# Altium project GPSDevice.PrjPcb
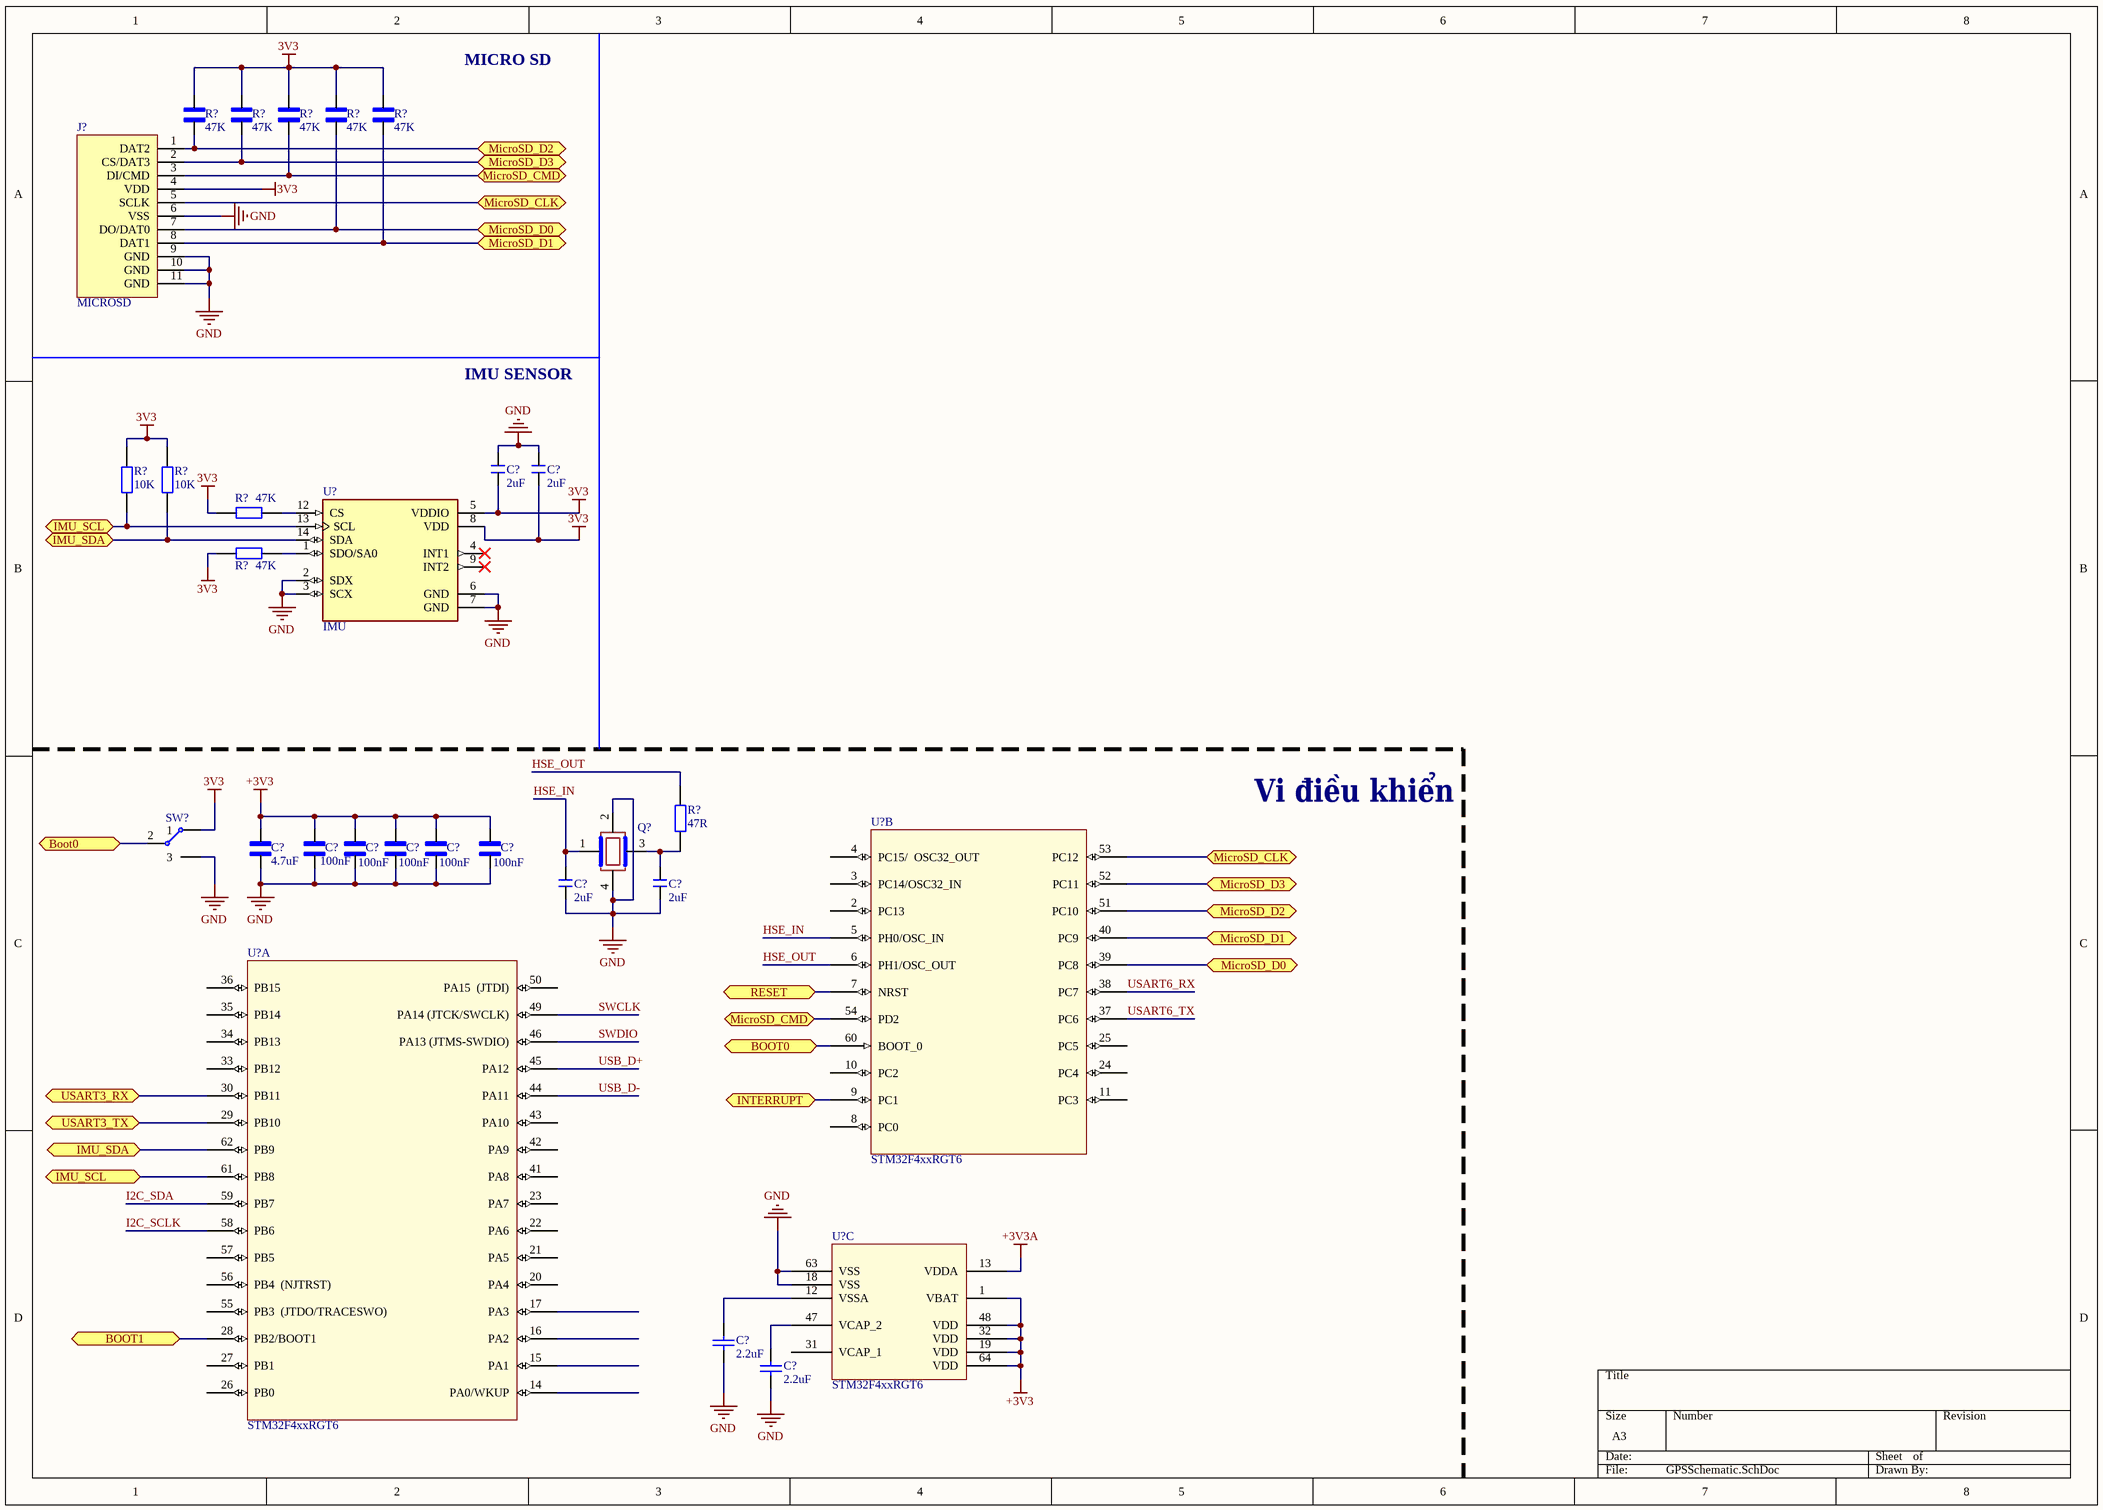
[diagram p0: GPSSchematic.SchDoc]
2 sheets, 84 parts. Net scope: flat (ports and power ports of the same name join across sheets).
Board file: GPSPCB.PcbDoc
Sheets:
  GPSSchematic.SchDoc
  Sim7600Schematic.SchDoc

## Sheet GPSSchematic.SchDoc
size A3

### Parts
(Parts that share a designator on the sheet are numbered #1, #2 ... from top to bottom, then left to right.)
C?#1  2uF  [CAPC 4.7uF 0603]
C?#2  2uF  [CAPC 4.7uF 0603]
C?#3  100nF  [CAP 0402]
C?#4  100nF  [CAP 0402]
C?#5  100nF  [CAP 0402]
C?#6  100nF  [CAP 0402]
C?#7  100nF  [CAP 0402]
C?#8  4.7uF  [CAPC 4.7uF 0603]
C?#9  2uF
C?#10  2uF
C?#11  2.2uF  [CAP 0402]
C?#12  2.2uF  [CAP 0402]
J?  MICROSD  [MICROSD]
Q?#1  CRYSTAL2  (value not drawn)
R?#1  47K  [RES 0402]
R?#2  47K  [RES 0402]
R?#3  47K  [RES 0402]
R?#4  47K  [RES 0402]
R?#5  47K  [RES 0402]
R?#6  10K  [RES 0603 47R]
R?#7  10K  [RES 0603 47R]
R?#8  47K  [RES 0603 47R]
R?#9  47K  [RES 0603 47R]
R?#10  47R  [RES 0603 47R]
SW?  Switch_Slide 3 Port  [Switch 4mm]  (value not drawn)
U?#1  IMU  [IMU]
U?#2  STM32F4xxRGT6  (part B of 3)
U?#3  STM32F4xxRGT6  (part A of 3)
U?#4  STM32F4xxRGT6  (part C of 3)

### Ports
BOOT0, Boot0, BOOT1, IMU_SCL, IMU_SDA, INTERRUPT, MicroSD_CLK, MicroSD_CMD, MicroSD_D0, MicroSD_D1, MicroSD_D2, MicroSD_D3, RESET, USART3_RX, USART3_TX

### Nets
3V3: C?#1.?1 C?#2.?1 J?.4(VDD) R?#1.1 R?#2.1 R?#3.1 R?#4.1 R?#5.1 R?#6.2 R?#7.2 R?#8.1 R?#9.1 SW?.1 U?#1.5(VDDIO) U?#1.8(VDD)
+3V3: C?#3.2 C?#4.2 C?#5.2 C?#6.2 C?#7.2 C?#8.2 U?#4.1(VBAT) U?#4.19(VDD) U?#4.32(VDD) U?#4.48(VDD) U?#4.64(VDD)
+3V3A: U?#4.13(VDDA)
GND: C?#1.?2 C?#2.?2 C?#3.1 C?#4.1 C?#5.1 C?#6.1 C?#7.1 C?#8.1 C?#9.?1 C?#10.?1 C?#11.1 C?#12.1 J?.6(VSS) J?.9(GND) J?.10(GND) J?.11(GND) Q?#1.2 Q?#1.4 SW?.3 U?#1.2(SDX) U?#1.3(SCX) U?#1.6(GND) U?#1.7(GND) U?#4.18(VSS) U?#4.63(VSS)
HSE_IN: C?#9.?2 Q?#1.1 U?#2.5(PH0/OSC_IN)
HSE_OUT: R?#10.2 U?#2.6(PH1/OSC_OUT)
I2C_SCLK: U?#3.58(PB6)
I2C_SDA: U?#3.59(PB7)
SWCLK: U?#3.49(PA14_(JTCK/SWCLK))
SWDIO: U?#3.46(PA13_(JTMS-SWDIO))
USART6_RX: U?#2.38(PC7)
USART6_TX: U?#2.37(PC6)
USB_D+: U?#3.45(PA12)
USB_D-: U?#3.44(PA11)
NetC?#10_?2: C?#10.?2 Q?#1.3 R?#10.1
NetC?#11_2: C?#11.2 U?#4.12(VSSA)
NetC?#12_2: C?#12.2 U?#4.47(VCAP_2)
NetJ?_1: J?.1(DAT2) R?#1.2 U?#2.51(PC10) ; port MicroSD_D2
NetJ?_2: J?.2(CS/DAT3) R?#2.2 U?#2.52(PC11) ; port MicroSD_D3
NetJ?_3: J?.3(DI/CMD) R?#3.2 U?#2.54(PD2) ; port MicroSD_CMD
NetJ?_5: J?.5(SCLK) U?#2.53(PC12) ; port MicroSD_CLK
NetJ?_7: J?.7(DO/DAT0) R?#4.2 U?#2.39(PC8) ; port MicroSD_D0
NetJ?_8: J?.8(DAT1) R?#5.2 U?#2.40(PC9) ; port MicroSD_D1
NetR?#6_1: R?#6.1 U?#1.13(SCL) U?#3.61(PB8) ; port IMU_SCL
NetR?#7_1: R?#7.1 U?#1.14(SDA) U?#3.62(PB9) ; port IMU_SDA
NetR?#8_2: R?#8.2 U?#1.12(CS)
NetR?#9_2: R?#9.2 U?#1.1(SDO/SA0)
NetSW?_2: SW?.2 U?#2.60(BOOT_0) ; port BOOT0, port Boot0
NetU?#2_7: U?#2.7(NRST) ; port RESET
NetU?#2_9: U?#2.9(PC1) ; port INTERRUPT
NetU?#3_28: U?#3.28(PB2/BOOT1) ; port BOOT1
NetU?#3_29: U?#3.29(PB10) ; port USART3_TX
NetU?#3_30: U?#3.30(PB11) ; port USART3_RX

Not connected (* = marked no-connect by the designer): U?#1 4(INT1)* 9(INT2)*; U?#2 2(PC13) 3(PC14/OSC32_IN) 4(PC15/__OSC32_OUT) 8(PC0) 10(PC2) 11(PC3) 24(PC4) 25(PC5); U?#3 14(PA0/WKUP) 15(PA1) 16(PA2) 17(PA3) 20(PA4) 21(PA5) 22(PA6) 23(PA7) 26(PB0) 27(PB1) 33(PB12) 34(PB13) 35(PB14) 36(PB15) 41(PA8) 42(PA9) 43(PA10) 50(PA15__(JTDI)) 55(PB3__(JTDO/TRACESWO)) 56(PB4__(NJTRST)) 57(PB5); U?#4 31(VCAP_1)

### Notes on the sheet
- MICRO SD
- IMU SENSOR
- Vi điều khiển

### Library data of the parts
C?#1 C?#2 C?#9 C?#10 = Cap 2uf 0603
C?#3-C?#7 = CAP 100nF
C?#8 = CAP 4.7uF: MP: GRM188C71C475KE21D; Package: None; Price: None; Value: *; Availability: Unavailable
C?#11 C?#12 = CAP 0402
R?#1-R?#5 = RES 0402: 1 kOhms Â±1% 0.1W, 1/10W Chip Resistor 0402 _1005 Metric_ Anti-Sulfur Thin Film; MP: S-0402; MF: Johanson; Price: None; Package: 0402 Johanson; Value: *; Availability: Unavailable; SnapEDA_Link: https://www.snapeda.com/parts/S-0402/Johanson/view-part/4220759/?ref=snap
R?#6-R?#10 = RES 47R 0603
SW? = Switch_Slide 3 Port: Manu numb: OS102011MS2QN1
U?#1 = IMU: Accelerometer, Gyroscope, Temperature, 6 Axis Sensor IÂ²C, SPI Output; MP: LSM6DSLTR; MF: STMicroelectronics; SnapEDA_Link: https://www.snapeda.com/parts/LSM6DSLTR/STMicroelectronics/view-part/550517/?ref=snap; Availability: Unavailable; Value: *; Price: None; Package: LGA-14 STMicroelectronics

## Sheet Sim7600Schematic.SchDoc
size A3
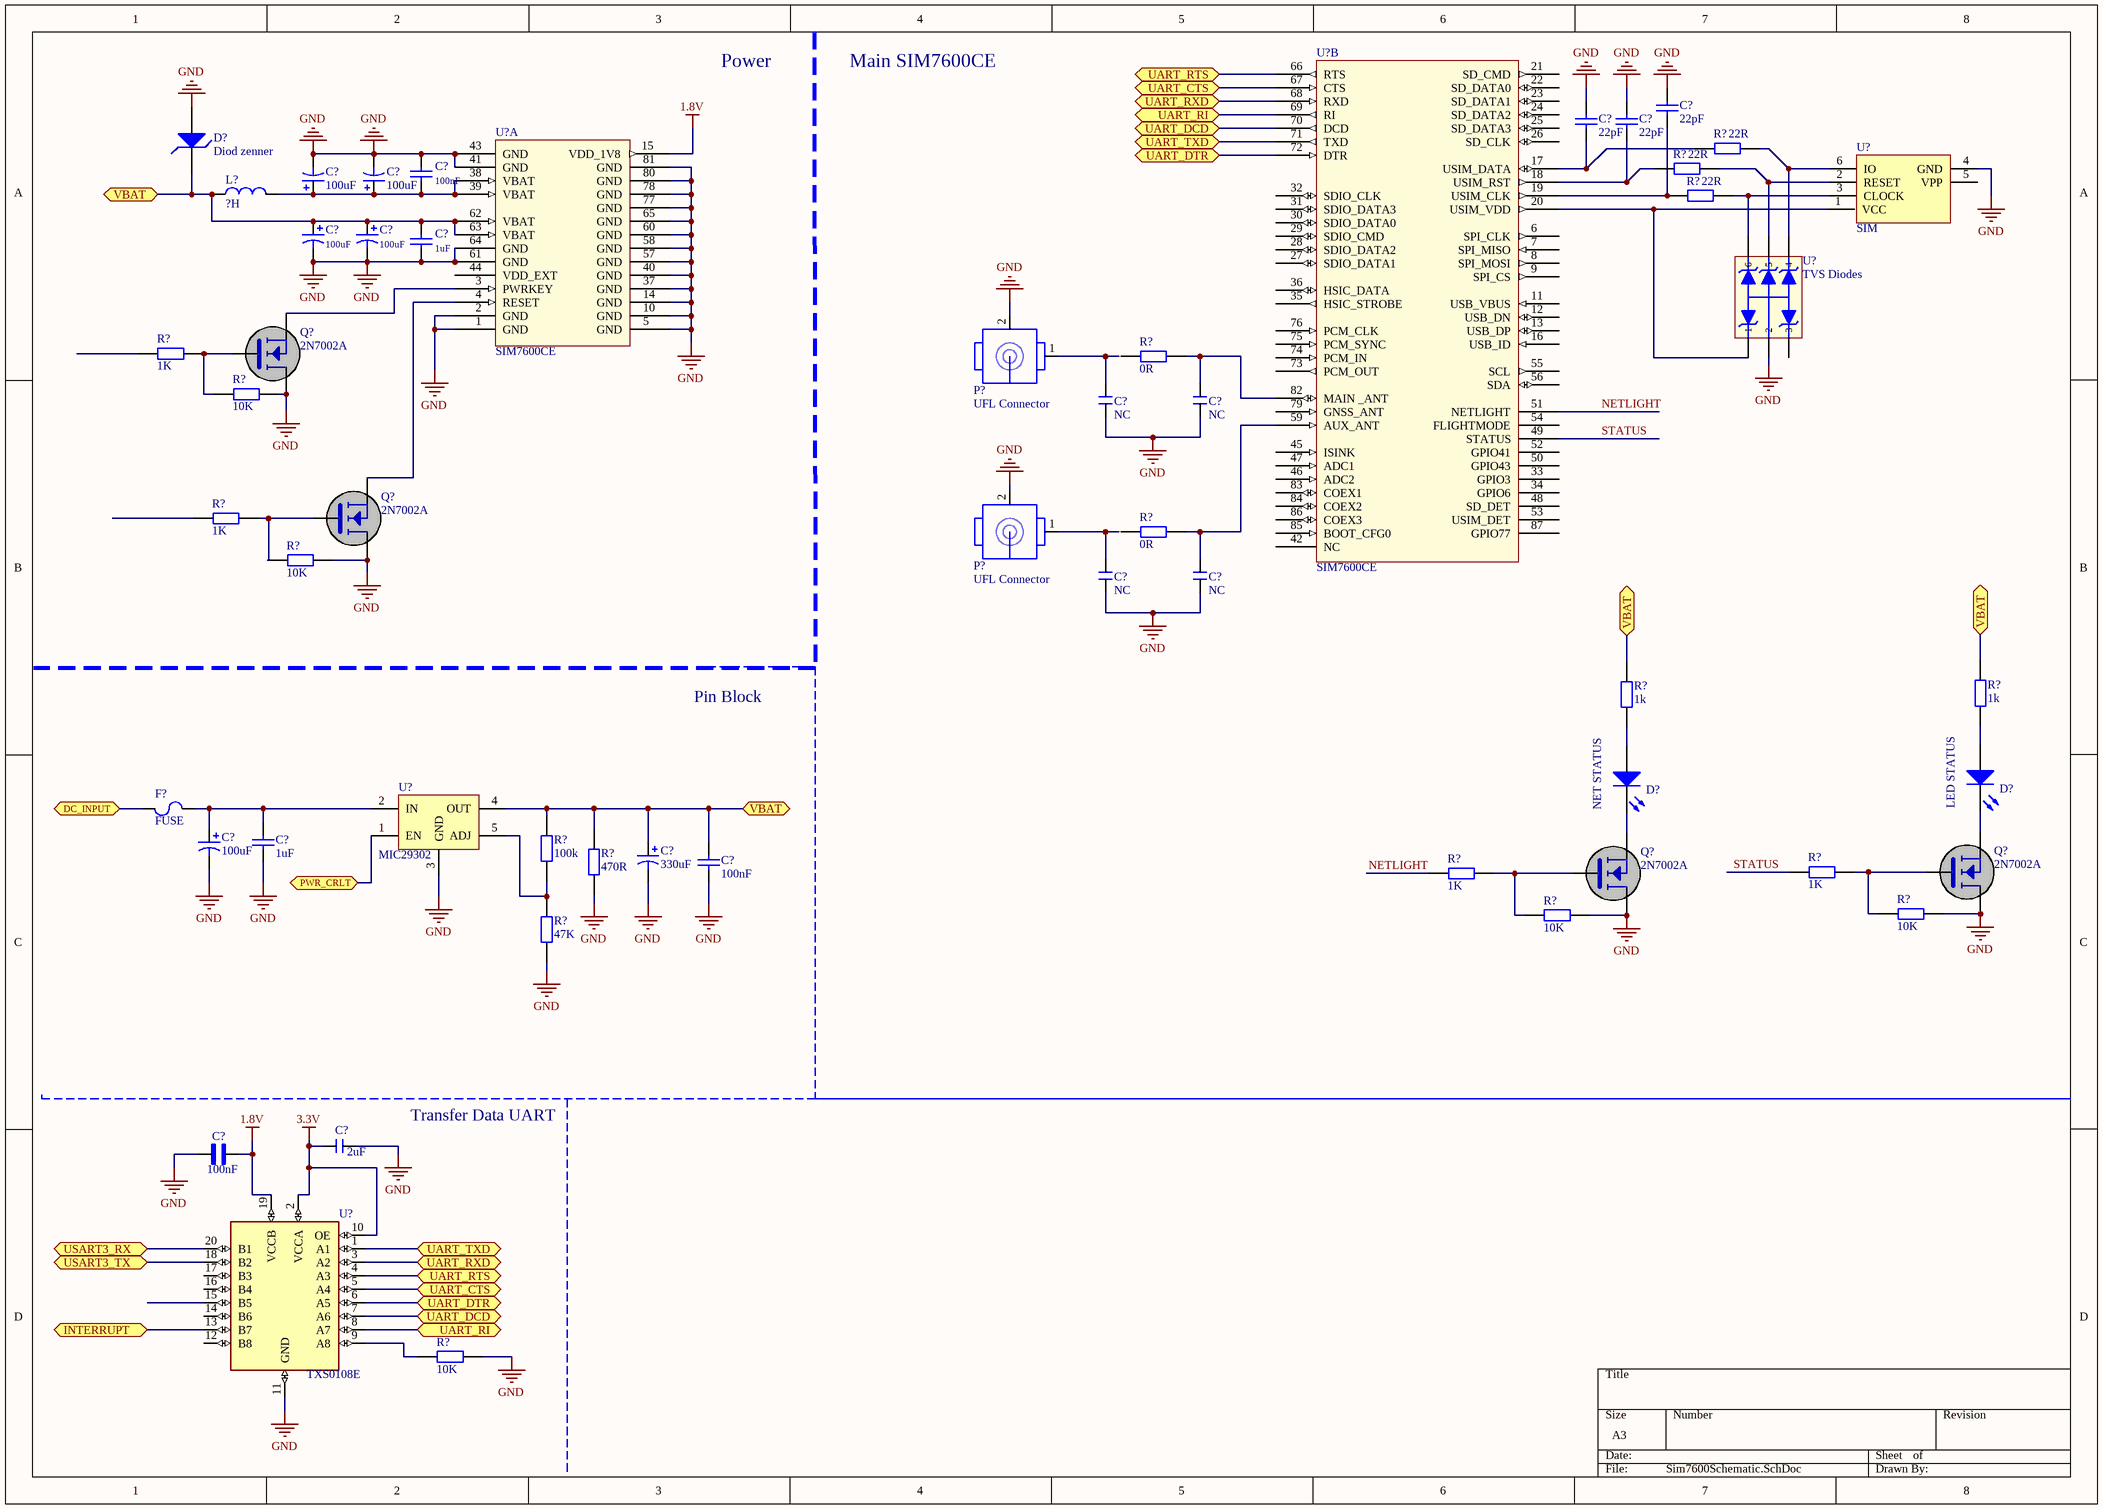
[diagram p1: Sim7600Schematic.SchDoc]

### Parts
(Parts that share a designator on the sheet are numbered #1, #2 ... from top to bottom, then left to right.)
C?#13  22pF
C?#14  22pF
C?#15  22pF
C?#16  100nF
C?#17  100uF
C?#18  100uF
C?#19  100uF
C?#20  100uF
C?#21  1uF
C?#22  NC  [CAPC 4.7uF 0603]
C?#23  NC  [CAPC 4.7uF 0603]
C?#24  NC  [CAPC 4.7uF 0603]
C?#25  NC  [CAPC 4.7uF 0603]
C?#26  100uF
C?#27  1uF
C?#28  330uF
C?#29  100nF
C?#30  2uF  [CAPC 4.7uF 0603]
C?#31  100nF  [CAP 0402]
D?#1  Diod zenner  [Diod Zener 1]
D?#2  LED STATUS  [LED2]
D?#3  NET STATUS  [LED2]
F?  FUSE  [FUSE-1206]
L?  ?H
P?#1  UFL Connector  [UFL Connector]
P?#2  UFL Connector  [UFL Connector]
Q?#2  2N7002A  [2N7002A]
Q?#3  2N7002A  [2N7002A]
Q?#4  2N7002A  [2N7002A]
Q?#5  2N7002A  [2N7002A]
R?#11  22R
R?#12  22R
R?#13  22R
R?#14  1K  [RES 0603 47R]
R?#15  0R  [RES 0603 47R]
R?#16  10K  [RES 0603 47R]
R?#17  1K  [RES 0603 47R]
R?#18  0R  [RES 0603 47R]
R?#19  10K  [RES 0603 47R]
R?#20  1k  [RES 0603 47R]
R?#21  1k  [RES 0603 47R]
R?#22  100k
R?#23  470R
R?#24  1K  [RES 0603 47R]
R?#25  1K  [RES 0603 47R]
R?#26  10K  [RES 0603 47R]
R?#27  10K  [RES 0603 47R]
R?#28  47K
R?#29  10K  [RES 0603 47R]
U?#5  SIM  [SIM-SOCKET1]
U?#6  SIM7600CE  [sim7600ce]  (part A of 2)
U?#7  SIM7600CE  [sim7600ce]  (part B of 2)
U?#8  TVS Diodes  [TVS Diod]
U?#9  MIC29302  [Microchip_MIC29302WU_0]
U?#10  TXS0108E  [PW_R-PDSO-G20]

### Ports
DC_INPUT, INTERRUPT, PWR_CRLT, UART_CTS, UART_DCD, UART_DTR, UART_RI, UART_RTS, UART_RXD, UART_TXD, USART3_RX, USART3_TX, VBAT

### Nets
1.8V: C?#31.2 U?#6.15(VDD_1V8) U?#10.19(VCCB)
3.3V: C?#30.?1 U?#10.2(VCCA) U?#10.10(OE)
GND: C?#13.2 C?#14.2 C?#15.2 C?#16.2 C?#17.2 C?#18.2 C?#19.2 C?#20.2 C?#21.1 C?#22.?1 C?#23.?1 C?#24.?1 C?#25.?1 C?#26.2 C?#27.1 C?#28.2 C?#29.1 C?#30.?2 C?#31.1 D?#1.1(A) P?#1.2 P?#2.2 Q?#2.3(D) Q?#3.3(D) Q?#4.3(D) Q?#5.3(D) R?#16.2 R?#19.2 R?#23.1 R?#26.2 R?#27.2 R?#28.1 R?#29.2 U?#5.4(GND) U?#6.1(GND) U?#6.2(GND) U?#6.5(GND) U?#6.10(GND) U?#6.14(GND) U?#6.37(GND) U?#6.40(GND) U?#6.41(GND) U?#6.43(GND) U?#6.57(GND) U?#6.58(GND) U?#6.60(GND) U?#6.61(GND) U?#6.64(GND) U?#6.65(GND) U?#6.77(GND) U?#6.78(GND) U?#6.80(GND) U?#6.81(GND) U?#8.9(2) U?#9.3(GND) U?#10.11(GND)
NETLIGHT: R?#25.1 U?#7.51(NETLIGHT)
STATUS: R?#24.1 U?#7.49(STATUS)
NetC?#13_1: C?#13.1 R?#13.1 U?#7.19(USIM_CLK)
NetC?#14_1: C?#14.1 R?#11.1 U?#7.17(USIM_DATA)
NetC?#15_1: C?#15.1 R?#12.1 U?#7.18(USIM_RST)
NetC?#16_1: C?#16.1 C?#17.1 C?#18.1 L?.4 U?#6.38(VBAT) U?#6.39(VBAT)
NetC?#19_1: C?#19.1 C?#20.1 C?#21.2 C?#28.1 C?#29.2 D?#1.2(K) L?.5 R?#20.2 R?#21.2 R?#22.2 R?#23.2 U?#6.62(VBAT) U?#6.63(VBAT) U?#9.4(OUT) ; port VBAT
NetC?#22_?2: C?#22.?2 P?#1.1
NetC?#23_?2: C?#23.?2 R?#15.2 U?#7.82(MAIN__ANT)
NetC?#24_?2: C?#24.?2 P?#2.1
NetC?#25_?2: C?#25.?2 R?#18.2 U?#7.59(AUX_ANT)
NetC?#26_1: C?#26.1 C?#27.2 F?.4 U?#9.2(IN)
NetD?#2_1: D?#2.1(A) R?#21.1
NetD?#2_2: D?#2.2(K) Q?#4.2(S)
NetD?#3_1: D?#3.1(A) R?#20.1
NetD?#3_2: D?#3.2(K) Q?#5.2(S)
NetF?_3: F?.3 ; port DC_INPUT
NetQ?#2_1: Q?#2.1(G) R?#14.2 R?#16.1
NetQ?#2_2: Q?#2.2(S) U?#6.3(PWRKEY)
NetQ?#3_1: Q?#3.1(G) R?#17.2 R?#19.1
NetQ?#3_2: Q?#3.2(S) U?#6.4(RESET)
NetQ?#4_1: Q?#4.1(G) R?#24.2 R?#27.1
NetQ?#5_1: Q?#5.1(G) R?#25.2 R?#26.1
NetR?#11_2: R?#11.2 U?#5.6(IO) U?#8.4
NetR?#12_2: R?#12.2 U?#5.2(RESET) U?#8.5
NetR?#13_2: R?#13.2 U?#5.3(CLOCK) U?#8.6
NetR?#22_1: R?#22.1 R?#28.2 U?#9.5(ADJ)
NetR?#29_1: R?#29.1 U?#10.9(A8)
NetU?#2_9: U?#10.13(B7) ; port INTERRUPT
NetU?#3_29: U?#10.18(B2) ; port USART3_TX
NetU?#3_30: U?#10.20(B1) ; port USART3_RX
NetU?#5_1: U?#5.1(VCC) U?#7.20(USIM_VDD) U?#8.1
NetU?#7_66: U?#7.66(RTS) U?#10.4(A3) ; port UART_RTS
NetU?#7_67: U?#7.67(CTS) U?#10.5(A4) ; port UART_CTS
NetU?#7_68: U?#7.68(RXD) U?#10.3(A2) ; port UART_RXD
NetU?#7_69: U?#7.69(RI) U?#10.8(A7) ; port UART_RI
NetU?#7_70: U?#7.70(DCD) U?#10.7(A6) ; port UART_DCD
NetU?#7_71: U?#7.71(TXD) U?#10.1(A1) ; port UART_TXD
NetU?#7_72: U?#7.72(DTR) U?#10.6(A5) ; port UART_DTR
NetU?#9_1: U?#9.1(EN) ; port PWR_CRLT

Not connected (* = marked no-connect by the designer): R?#14 1; R?#15 1; R?#17 1; R?#18 1; U?#5 5(VPP); U?#6 44(VDD_EXT); U?#7 6(SPI_CLK) 7(SPI_MISO) 8(SPI_MOSI) 9(SPI_CS) 11(USB_VBUS) 12(USB_DN) 13(USB_DP) 16(USB_ID) 21(SD_CMD) 22(SD_DATA0) 23(SD_DATA1) 24(SD_DATA2) 25(SD_DATA3) 26(SD_CLK) 27(SDIO_DATA1) 28(SDIO_DATA2) 29(SDIO_CMD) 30(SDIO_DATA0) 31(SDIO_DATA3) 32(SDIO_CLK) 33(GPIO3) 34(GPIO6) 35(HSIC_STROBE) 36(HSIC_DATA) 42(NC) 45(ISINK) 46(ADC2) 47(ADC1) 48(SD_DET) 50(GPIO43) 52(GPIO41) 53(USIM_DET) 54(FLIGHTMODE) 55(SCL) 56(SDA) 73(PCM_OUT) 74(PCM_IN) 75(PCM_SYNC) 76(PCM_CLK) 79(GNSS_ANT) 83(COEX1) 84(COEX2) 85(BOOT_CFG0) 86(COEX3) 87(GPIO77); U?#8 3; U?#10 12(B8) 14(B6) 15(B5) 16(B4) 17(B3)

### Notes on the sheet
- Power
- Main SIM7600CE
- Pin Block
- Transfer Data UART

### Library data of the parts
C?#13-C?#16 C?#21 C?#27 C?#29 = Cap khong phan cuc
C?#17-C?#20 C?#26 C?#28 = Capacitor
C?#22-C?#25 C?#30 = Cap 2uf 0603
C?#31 = CAP 100nF
D?#2 D?#3 = LED
L? = Cuon cam Inductor
R?#11-R?#13 R?#22 R?#23 R?#28 = Resistor
R?#14-R?#21 R?#24-R?#27 R?#29 = RES 47R 0603
U?#5 = SIM_02
U?#10 = TXS0108E: Voltage Level Translator Bidirectional 1 Circuit 8 Channel 60Mbps 20-VQFN (3.5x4.5); MF: Texas Instruments; Purchase-URL: https://pricing.snapeda.com/search/part/TXS0108E/?ref=eda; Package: None; SnapEDA_Link: https://www.snapeda.com/parts/TXS0108E/Texas+Instruments/view-part/?ref=snap; Value: *; Check_prices: https://www.snapeda.com/parts/TXS0108E/Texas+Instruments/view-part/?ref=eda; Price: None; MP: TXS0108E; Availability: In Stock

## Nets that join several sheets
GND: GPSSchematic (25 pins), Sim7600Schematic (56 pins)
NetU?#2_9: GPSSchematic (U?#2.9), Sim7600Schematic (U?#10.13)
NetU?#3_29: GPSSchematic (U?#3.29), Sim7600Schematic (U?#10.18)
NetU?#3_30: GPSSchematic (U?#3.30), Sim7600Schematic (U?#10.20)